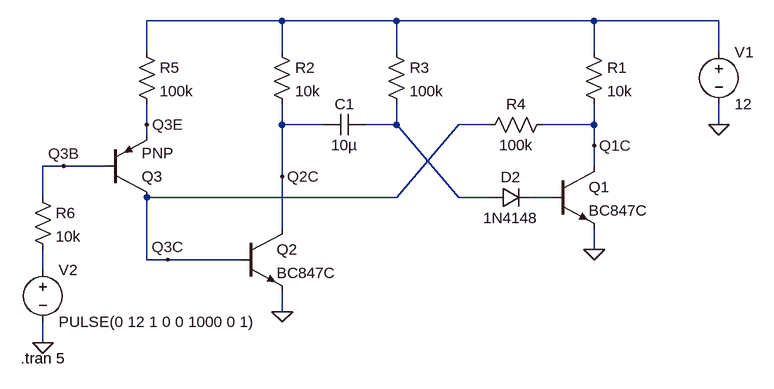
[diagram p0: schematic monoflop.asc]
monoflop.asc, the LTspice schematic file:
Version 4
SHEET 1 956 680
WIRE -160 -80 -368 -80
WIRE 16 -80 -160 -80
WIRE 320 -80 16 -80
WIRE 512 -80 320 -80
WIRE -368 -32 -368 -80
WIRE -160 -32 -160 -80
WIRE 16 -32 16 -80
WIRE 320 -32 320 -80
WIRE 512 -32 512 -80
WIRE -368 80 -368 48
WIRE -160 80 -160 48
WIRE -96 80 -160 80
WIRE 16 80 16 48
WIRE 16 80 -32 80
WIRE 160 80 112 80
WIRE 320 80 320 48
WIRE 320 80 240 80
WIRE 512 80 512 48
WIRE -368 96 -368 80
WIRE 320 112 320 80
WIRE -496 144 -528 144
WIRE -432 144 -496 144
WIRE 320 144 320 112
WIRE -160 160 -160 80
WIRE -528 192 -528 144
WIRE 16 192 112 80
WIRE 16 192 -368 192
WIRE 112 192 16 80
WIRE 160 192 112 192
WIRE 256 192 224 192
WIRE -160 240 -160 160
WIRE 320 272 320 240
WIRE -368 288 -368 192
WIRE -336 288 -368 288
WIRE -224 288 -336 288
WIRE -528 304 -528 272
WIRE -160 368 -160 336
WIRE -528 416 -528 384
FLAG 320 272 0
FLAG -160 368 0
FLAG 512 80 0
FLAG -528 416 0
FLAG 320 112 Q1C
FLAG -160 160 Q2C
FLAG -336 288 Q3C
FLAG -496 144 Q3B
FLAG -368 80 Q3E
SYMBOL npn 256 144 R0
SYMATTR InstName Q1
SYMATTR Value BC847C
SYMBOL res 304 -48 R0
SYMATTR InstName R1
SYMATTR Value 10k
SYMBOL npn -224 240 R0
SYMATTR InstName Q2
SYMATTR Value BC847C
SYMBOL res -176 -48 R0
SYMATTR InstName R2
SYMATTR Value 10k
SYMBOL res 0 -48 R0
SYMATTR InstName R3
SYMATTR Value 100k
SYMBOL cap -32 64 R90
WINDOW 0 0 32 VBottom 2
WINDOW 3 32 32 VTop 2
SYMATTR InstName C1
SYMATTR Value 10µ
SYMBOL diode 160 208 R270
WINDOW 0 32 32 VTop 2
WINDOW 3 0 32 VBottom 2
SYMATTR InstName D2
SYMATTR Value 1N4148
SYMBOL res 256 64 R90
WINDOW 0 0 56 VBottom 2
WINDOW 3 32 56 VTop 2
SYMATTR InstName R4
SYMATTR Value 100k
SYMBOL voltage 512 -48 R0
WINDOW 123 0 0 Left 0
WINDOW 39 0 0 Left 0
SYMATTR InstName V1
SYMATTR Value 12
SYMBOL pnp -432 192 M180
SYMATTR InstName Q3
SYMBOL res -384 -48 R0
SYMATTR InstName R5
SYMATTR Value 100k
SYMBOL voltage -528 288 R0
WINDOW 123 0 0 Left 0
WINDOW 39 0 0 Left 0
SYMATTR InstName V2
SYMATTR Value PULSE(0 12 1 0 0 1000 0 1)
SYMBOL res -544 176 R0
SYMATTR InstName R6
SYMATTR Value 10k
TEXT -562 440 Left 2 !.tran 5

The netlist it stands for:
* monoflop.asc
Q1 Q1C N003 0 0 BC847C
R1 N001 Q1C 10k
Q2 Q2C Q3C 0 0 BC847C
R2 N001 Q2C 10k
R3 N001 N002 100k
C1 N002 Q2C 10µ
D2 N002 N003 1N4148
R4 Q1C Q3C 100k
V1 N001 0 12
Q3 Q3C Q3B Q3E 0 PNP
R5 N001 Q3E 100k
V2 N004 0 PULSE(0 12 1 0 0 1000 0 1)
R6 Q3B N004 10k
.model D D
.lib standard.dio
.model NPN NPN
.model PNP PNP
.lib standard.bjt
.tran 5
.backanno
.end